# Altium schematic sheet AHT20_DEMO_V1.5.schdoc
size A4; Date: 2012-07-12; Revision: V1.5; DocumentName: AHT20演示板; ProjectName: AHT20_DEMO _BORAD
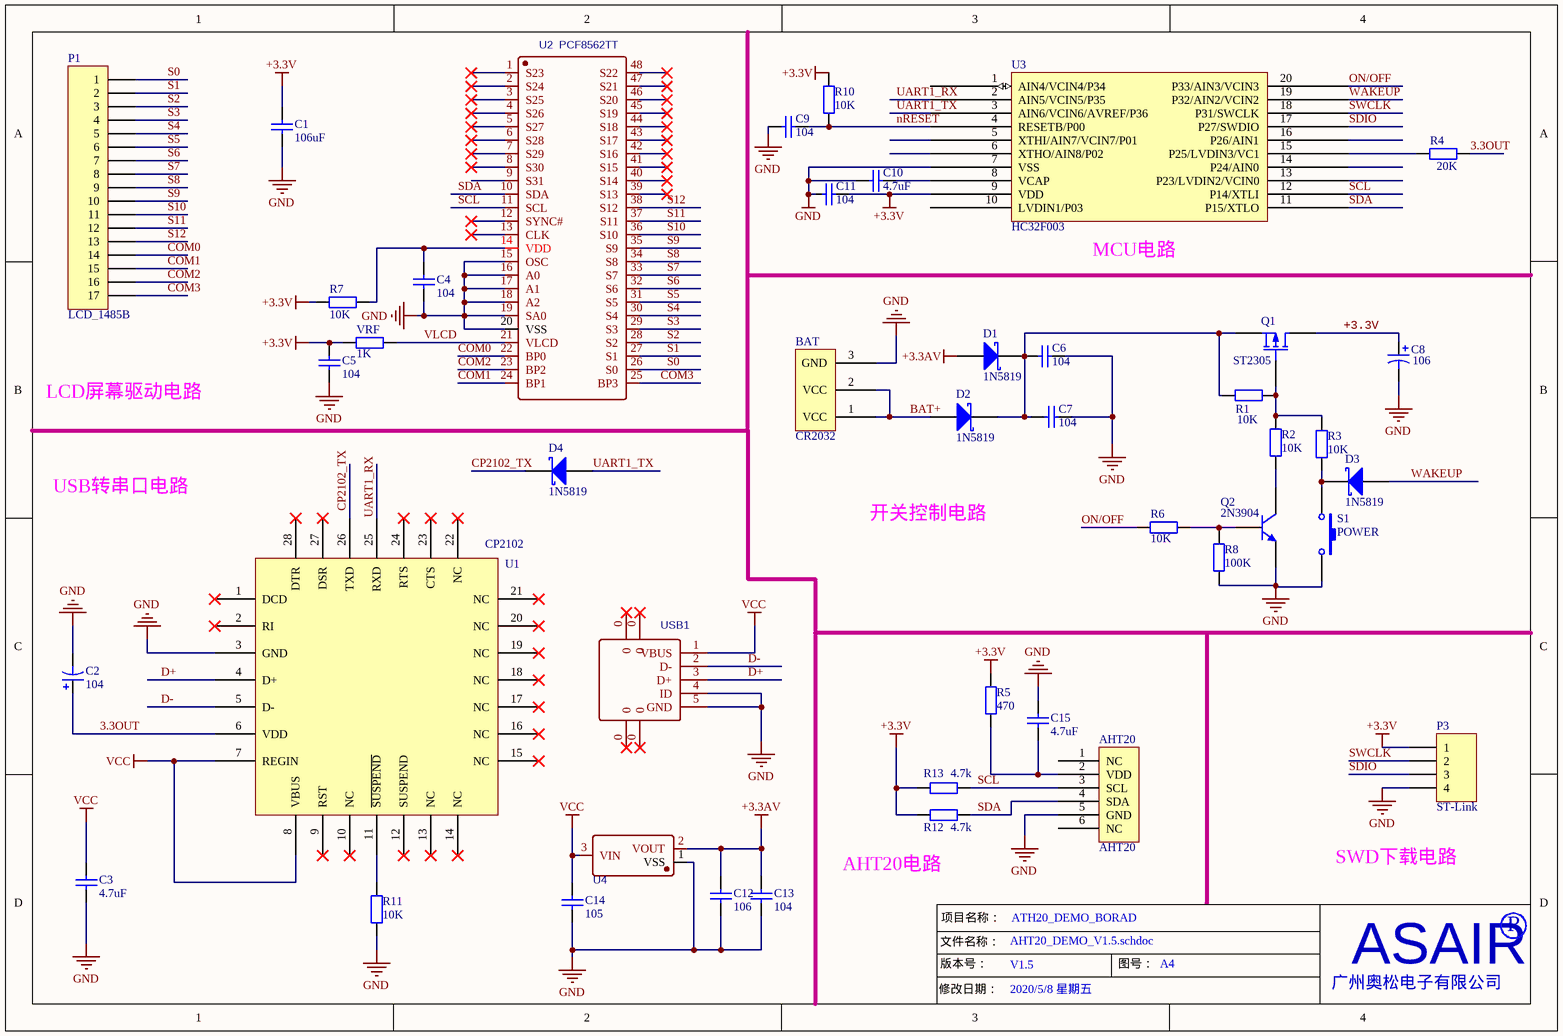
[diagram p0: AHT20_DEMO_V1.5.schdoc]

## Parts
AHT20  AHT20  [AHT20]
BAT  CR2032  [CR2032-W]
C1  106uF  [0603C]
C2  104  [0603c]
C3  4.7uF  [0603C]
C4  104  [0603C]
C5  104  [0603C]
C6  104  [0603C]
C7  104  [0603C]
C8  106  [0603c]
C9  104  [0603C]
C10  4.7uF  [0603C]
C11  104  [0603C]
C12  value 106  [0603C]  (hidden comment: 104)
C13  104  [0603C]
C14  value 105  [0603C]  (hidden comment: 104)
C15  4.7uF  [0603C]
D1  1N5819  [0805-LED]
D2  1N5819  [0805-LED]
D3  1N5819  [0805-LED]
D4  1N5819  [0805-LED]
P1  LCD_1485B  [LCD1485B]
P3  ST-Link  [DIP-5]
Q1  ST2305  [SOt23]
Q2  2N3904  [SOt23]
R1  10K  [0603R]
R2  10K  [0603R]
R3  10K  [0603R]
R4  20K  [0603R]
R5  470  [0603R]
R6  10K  [0603R]
R7  10K  [0603R]
R8  100K  [0603R]
R10  10K  [0603R]
R11  10K  [0603R]
R12  4.7k  [0603R]
R13  4.7k  [0603R]
S1  POWER  [KEY]
U1  CP2102  [CP2102]
U2  PCF8562TT  [PCF8562TT]
U3  HC32F003  [TSSOP20]
U4  XC6206P282MR_C347374  [XC6206]  (value not drawn)
USB1  micro 5P_C77238  [USB]  (value not drawn)
VRF  1K  [0603R]

## Nets
+3.3AV: C12.2 C13.2 D1.1(A) U4.2(VOUT)
+3.3V: C1.2 C5.2 C8.1 C11.2 P3.1 Q1.1(D) R5.2 R7.2 R10.1 R12.1 R13.1 U3.9(VDD) VRF.1
GND: AHT20.5(GND) BAT.3(GND) C1.1 C2.2 C3.1 C4.1 C5.1 C6.2 C7.2 C8.2 C9.1 C10.1 C11.1 C12.1 C13.1 C14.1 C15.1 P3.4 Q2.1(E) R8.2 R11.2 S1.2 U1.3(GND) U2.15(OSC) U2.16(A0) U2.17(A1) U2.18(A2) U2.19(SA0) U2.20(VSS) U3.7(VSS) U4.1(VSS) USB1.4(ID) USB1.5(GND)
VCC: C3.2 C14.2 U1.7(REGIN) U1.8(VBUS) U4.3(VIN) USB1.1(VBUS)
3.3OUT: C2.1 R4.2 U1.6(VDD)
BAT+: BAT.1(VCC) BAT.2(VCC) D2.1(A)
COM0: P1.14 U2.22(BP0)
COM1: P1.15 U2.24(BP1)
COM2: P1.16 U2.23(BP2)
COM3: P1.17 U2.25(BP3)
CP2102_TX: D4.2(K) U1.26(TXD)
D+: U1.4(D+) USB1.3(D+)
D-: U1.5(D-) USB1.2(D-)
nRESET: C9.2 R10.2 U3.4(RESETB/P00)
ON/OFF: R6.1 U3.20(P33/AIN3/VCIN3)
S0: P1.1 U2.26(S0)
S1: P1.2 U2.27(S1)
S2: P1.3 U2.28(S2)
S3: P1.4 U2.29(S3)
S4: P1.5 U2.30(S4)
S5: P1.6 U2.31(S5)
S6: P1.7 U2.32(S6)
S7: P1.8 U2.33(S7)
S8: P1.9 U2.34(S8)
S9: P1.10 U2.35(S9)
S10: P1.11 U2.36(S10)
S11: P1.12 U2.37(S11)
S12: P1.13 U2.38(S12)
SCL: AHT20.3(SCL) R13.2 U2.11(SCL) U3.12(P14/XTLI)
SDA: AHT20.4(SDA) R12.2 U2.10(SDA) U3.11(P15/XTLO)
SDIO: P3.3 U3.17(P27/SWDIO)
SWCLK: P3.2 U3.18(P31/SWCLK)
UART1_RX: U1.25(RXD) U3.2(AIN5/VCIN5/P35)
UART1_TX: D4.1(A) U3.3(AIN6/VCIN6/AVREF/P36)
VLCD: U2.21(VLCD) VRF.2
WAKEUP: D3.1(A) U3.19(P32/AIN2/VCIN2)
NetAHT20_2: AHT20.2(VDD) C15.2 R5.1
NetC4_2: C4.2 R7.1 U2.14(VDD)
NetC6_1: C6.1 C7.1 D1.2(K) D2.2(K) Q1.3(S) R1.2
NetC10_2: C10.2 U3.8(VCAP)
NetD3_2: D3.2(K) R3.2 S1.1
NetQ1_2: Q1.2(G) R1.1 R2.1 R3.1
NetQ2_2: Q2.2(B) R6.2 R8.1
NetQ2_3: Q2.3(C) R2.2
NetR4_1: R4.1 U3.15(P25/LVDIN3/VC1)
NetR11_1: R11.1 U1.11(~{SUSPEND})

Not connected (* = marked no-connect by the designer): AHT20 1(NC) 6(NC); U1 1(DCD)* 2(RI)* 9(RST)* 10(NC)* 12(SUSPEND)* 13(NC)* 14(NC)* 15(NC)* 16(NC)* 17(NC)* 18(NC)* 19(NC)* 20(NC)* 21(NC)* 22(NC)* 23(CTS)* 24(RTS)* 27(DSR)* 28(DTR)*; U2 1(S23)* 2(S24)* 3(S25)* 4(S26)* 5(S27)* 6(S28)* 7(S29)* 8(S30)* 9(S31) 12(SYNC#)* 13(CLK)* 39(S13)* 40(S14)* 41(S15)* 42(S16)* 43(S17)* 44(S18)* 45(S19)* 46(S20)* 47(S21)* 48(S22)*; U3 1(AIN4/VCIN4/P34) 5(XTHI/AIN7/VCIN7/P01) 6(XTHO/AIN8/P02) 10(LVDIN1/P03) 13(P23/LVDIN2/VCIN0) 14(P24/AIN0) 16(P26/AIN1); USB1 0*

## Notes on the sheet
- (near U3) MCU电路
- LCD屏幕驱动电路
- USB转串口电路
- 开关控制电路
- AHT20电路
- 项目名称：
- ATH20_DEMO_BORAD
- SWD下载电路
- 文件名称：
- 版本号：
- AHT20_DEMO_V1.5.schdoc
- V1.5
- 图号：
- A4
- 广州奥松电子有限公司
- ASAIR
- R
- 修改日期：
- 2020/5/8 星期五
- 文件名：
- 标记
- 日期：
- 编号：
- 设计：
- 审核：
- 审批：
- 广州奥松电子
- 共
- 张
- 第

## Library data of the parts
C1 C3 C10 C15 = Cap: Capacitor; Value: 105; Published: 8-Jun-2000; LatestRevisionDate: 17-Jul-2002; LatestRevisionNote: Re-released for DXP Platform.; PackageReference: RAD-0.3; Publisher: Altium Limited
C2 C8 = Cap Pol1: Polarized Capacitor (Radial); Value: 10uF; Published: 8-Jun-2000; LatestRevisionDate: 17-Jul-2002; LatestRevisionNote: Re-released for DXP Platform.; PackageReference: RB7.6-15; Publisher: Altium Limited
C4-C7 C9 C11-C14 = Cap: Capacitor; Published: 8-Jun-2000; LatestRevisionDate: 17-Jul-2002; LatestRevisionNote: Re-released for DXP Platform.; PackageReference: RAD-0.3; Publisher: Altium Limited
  C4-C7 C9 C11 C13: Value: 104
D1-D4 = D Schottky: Schottky Diode; Published: 8-Jun-2000; LatestRevisionDate: 17-Jul-2002; LatestRevisionNote: Re-released for DXP Platform.; PackageReference: SMB; Publisher: Altium Limited; Code_JEDEC: DO-214-AA
P1 = LED1485B: Header, 17-Pin; LatestRevisionDate: 17-Jul-2002; LatestRevisionNote: Re-released for DXP Platform.; Publisher: Altium Limited
P3 = Header 4: Header, 4-Pin; LatestRevisionDate: 17-Jul-2002; LatestRevisionNote: Re-released for DXP Platform.; Publisher: Altium Limited
Q1 = MOSFET-P: P-Channel MOSFET; pin to pad: 1>3 2>1 3>2; Published: 8-Jun-2000; LatestRevisionDate: 17-Jul-2002; LatestRevisionNote: Re-released for DXP Platform.; PackageVersion: 1995/1996; PackageReference: E3; Publisher: Altium Limited
Q2 = 2N3904: NPN General Purpose Amplifier; pin to pad: 1>2 2>1; Published: 8-Jun-2000; LatestRevisionDate: 15-Jan-2003; LatestRevisionNote: PCB Footprint 'BCY-W3/D4.7' replaced; DatasheetVersion: 1997; PackageVersion: Sep-1998; PackageReference: TO-92A; Publisher: Altium Limited; Code_JEDEC: TO-92A; ComponentLink1Description: Manufacturer Link; ComponentLink1URL: http://www.fairchildsemi.com/; ComponentLink2Description: Datasheet; ComponentLink2URL: http://www.fairchildsemi.com/ds/2N%2F2N3904.pdf
R1-R4 R6 R8 R11 = Res2: Resistor; Value: 100; Published: 8-Jun-2000; LatestRevisionDate: 17-Jul-2002; LatestRevisionNote: Re-released for DXP Platform.; PackageReference: AXIAL-0.4; Publisher: Altium Limited
R5 = Res2: Resistor; Value: 4.7K; Published: 8-Jun-2000; LatestRevisionDate: 17-Jul-2002; LatestRevisionNote: Re-released for DXP Platform.; PackageReference: AXIAL-0.4; Publisher: Altium Limited
R7 R10 R12 R13 VRF = Res2: Resistor; Published: 8-Jun-2000; LatestRevisionDate: 17-Jul-2002; LatestRevisionNote: Re-released for DXP Platform.; PackageReference: AXIAL-0.4; Publisher: Altium Limited
  R7 R10: Value: 10K
  R12 R13: Value: 4.7K
  VRF: Value: 1K
S1 = SW-PB: Switch; Published: 24-Mar-1999; LatestRevisionDate: 17-Jul-2002; LatestRevisionNote: Re-released for DXP Platform.; PackageReference: SPST-2; Publisher: Altium Limited
U1 = CP2102_1
U2 = PCF8562TT: BOM_Manufacturer: NXP; SMT Type: Extend; spicePre: X; BOM_BOM_Supplier: LCSC; BOM_Manufacturer Part: PCF8562TT; BOM_Supplier Part: C52805; BOM_Supplier: LCSC; BOM_LCSC Assembly: Yes; spiceSymbolName: PCF8562TT
U3 = HC32F003: MCU
U4 = XC6206P282MR_C347374: BOM_Manufacturer: Youtai Semiconductor Co., Ltd.; Contributor: LCSC; SMT Type: Extend; BOM_Supplier: LCSC; BOM_Supplier Part: C347374; BOM_Manufacturer Part: XC6206P282MR; BOM_LCSC Assembly: Yes; spicePre: U; spiceSymbolName: XC6206P282MR_C347374
USB1 = micro 5P_C77238: BOM_Manufacturer: LCSC; Contributor: 立创EDA官方封装库; BOM_Supplier: LCSC; BOM_Supplier Part: C77238; BOM_Manufacturer Part: -; spicePre: U; spiceSymbolName: micro 5P_C77238